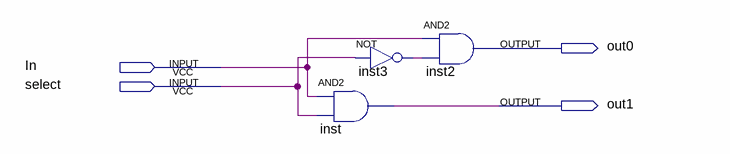
[diagram p0: schematic sheet]
// Quartus schematic select_convayer.bdf as structural Verilog: 3 symbols, 4 pins
module select_convayer (
  input  In,
  input  select,
  output out0,
  output out1
);

  wire inst3_out;

  and inst (out1, In, select);
  not inst3 (inst3_out, select);
  and inst2 (out0, In, inst3_out);
endmodule
